# Altium schematic sheet MCU_TOPA.SchDoc
size A3
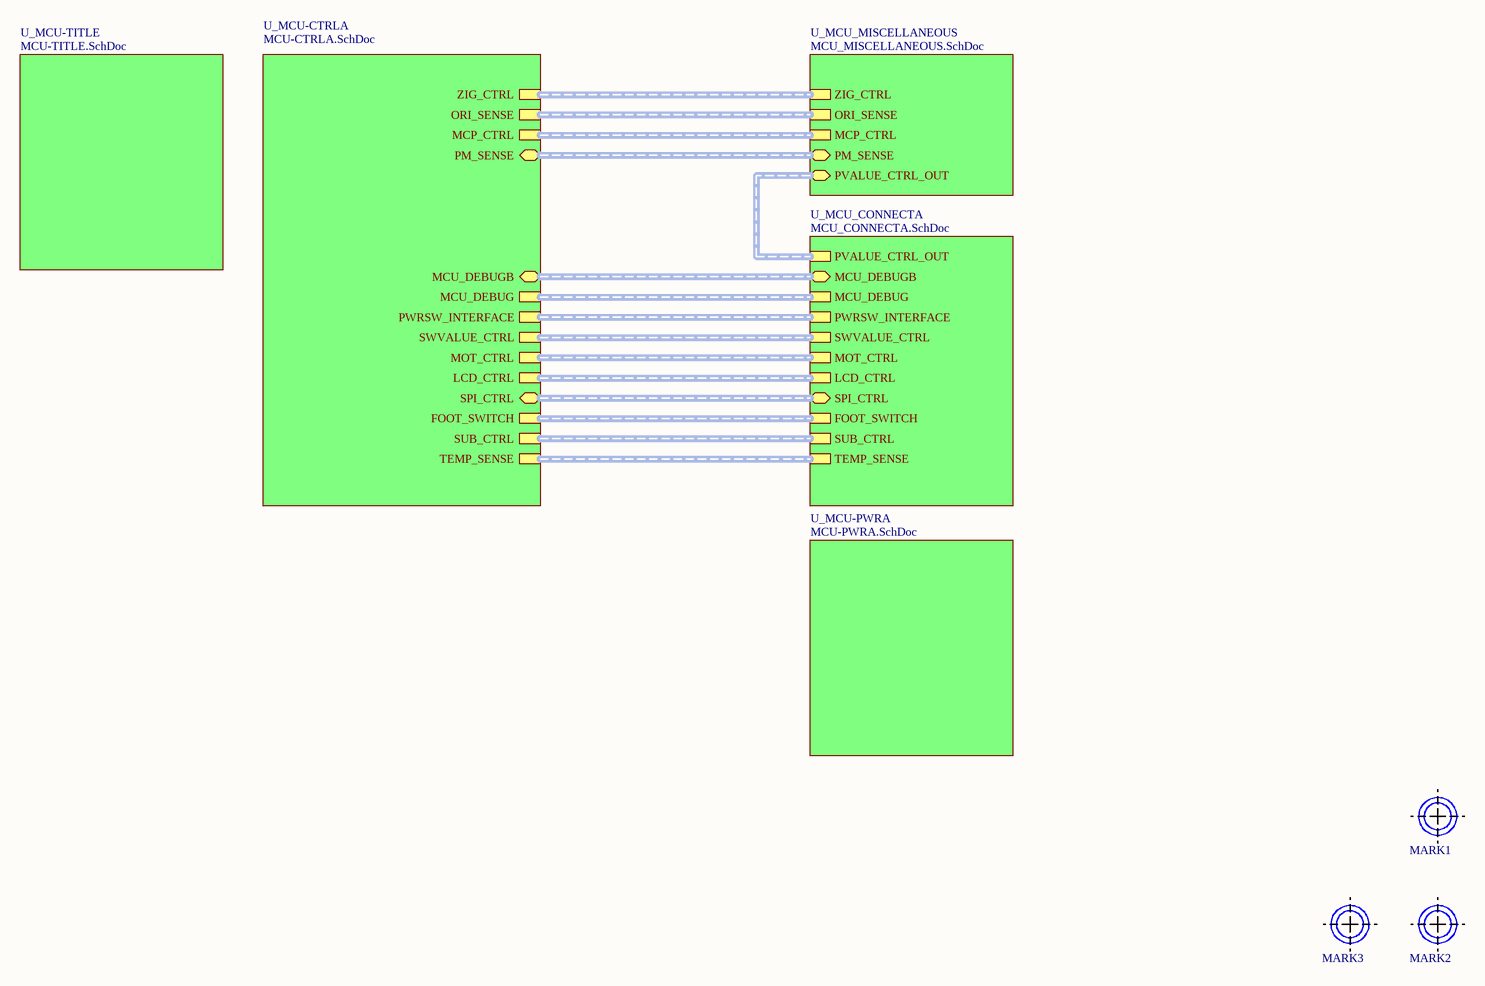
[diagram p0: MCU_TOPA.SchDoc]

## Parts
MARK1  MARK  [RCTOOL_MARK]  (value not drawn)
MARK2  MARK  [RCTOOL_MARK]  (value not drawn)
MARK3  MARK  [RCTOOL_MARK]  (value not drawn)

## Sub-sheets
U_MCU-CTRLA = MCU-CTRLA.SchDoc: ORI_SENSE (harness ORI_SENSE), ZIG_CTRL (harness ZIG_CTRL), SWVALUE_CTRL (harness SWVALUE_CTRL), SUB_CTRL (harness SUB_CTRL), MCU_DEBUG (harness MCU_DEBUG), FOOT_SWITCH (harness FOOT_SWITCH), LCD_CTRL (harness LCD_CTRL), MOT_CTRL (harness MOT_CTRL), TEMP_SENSE (harness TEMP_SENSE), MCP_CTRL (harness MCP_CTRL), PWRSW_INTERFACE (harness PWRSW_INTERFACE), MCU_DEBUGB (harness MCU_DEBUGB), PM_SENSE (harness PM_SENSE), SPI_CTRL (harness SPI_CTRL)
U_MCU-PWRA = MCU-PWRA.SchDoc: no entries
U_MCU-TITLE = MCU-TITLE.SchDoc: no entries
U_MCU_CONNECTA = MCU_CONNECTA.SchDoc: MCU_DEBUG (harness MCU_DEBUG), LCD_CTRL (harness LCD_CTRL), FOOT_SWITCH (harness FOOT_SWITCH), MOT_CTRL (harness MOT_CTRL), PVALUE_CTRL_OUT (harness PVALUE_CTRL_OUT), TEMP_SENSE (harness TEMP_SENSE), SWVALUE_CTRL (harness SWVALUE_CTRL), PWRSW_INTERFACE (harness PWRSW_INTERFACE), SUB_CTRL (harness SUB_CTRL), MCU_DEBUGB (harness MCU_DEBUGB), SPI_CTRL (harness SPI_CTRL)
U_MCU_MISCELLANEOUS = MCU_MISCELLANEOUS.SchDoc: ORI_SENSE (harness ORI_SENSE), ZIG_CTRL (harness ZIG_CTRL), MCP_CTRL (harness MCP_CTRL), PVALUE_CTRL_OUT (harness PVALUE_CTRL_OUT), PM_SENSE (harness PM_SENSE)

## Buses and harness runs
harness sheet U_MCU-CTRLA/FOOT_SWITCH = sheet U_MCU_CONNECTA/FOOT_SWITCH
harness sheet U_MCU-CTRLA/LCD_CTRL = sheet U_MCU_CONNECTA/LCD_CTRL
harness sheet U_MCU-CTRLA/MCP_CTRL = sheet U_MCU_MISCELLANEOUS/MCP_CTRL
harness sheet U_MCU-CTRLA/MCU_DEBUG = sheet U_MCU_CONNECTA/MCU_DEBUG
harness sheet U_MCU-CTRLA/MCU_DEBUGB = sheet U_MCU_CONNECTA/MCU_DEBUGB
harness sheet U_MCU-CTRLA/MOT_CTRL = sheet U_MCU_CONNECTA/MOT_CTRL
harness sheet U_MCU-CTRLA/ORI_SENSE = sheet U_MCU_MISCELLANEOUS/ORI_SENSE
harness sheet U_MCU-CTRLA/PM_SENSE = sheet U_MCU_MISCELLANEOUS/PM_SENSE
harness sheet U_MCU-CTRLA/PWRSW_INTERFACE = sheet U_MCU_CONNECTA/PWRSW_INTERFACE
harness sheet U_MCU-CTRLA/SPI_CTRL = sheet U_MCU_CONNECTA/SPI_CTRL
harness sheet U_MCU-CTRLA/SUB_CTRL = sheet U_MCU_CONNECTA/SUB_CTRL
harness sheet U_MCU-CTRLA/SWVALUE_CTRL = sheet U_MCU_CONNECTA/SWVALUE_CTRL
harness sheet U_MCU-CTRLA/TEMP_SENSE = sheet U_MCU_CONNECTA/TEMP_SENSE
harness sheet U_MCU-CTRLA/ZIG_CTRL = sheet U_MCU_MISCELLANEOUS/ZIG_CTRL
harness sheet U_MCU_CONNECTA/PVALUE_CTRL_OUT = sheet U_MCU_MISCELLANEOUS/PVALUE_CTRL_OUT

## Notes on the sheet
- 项目
- 时间
- 版本/修订
- 编制
- 第
- 审核
- 张
- 共
- 备注